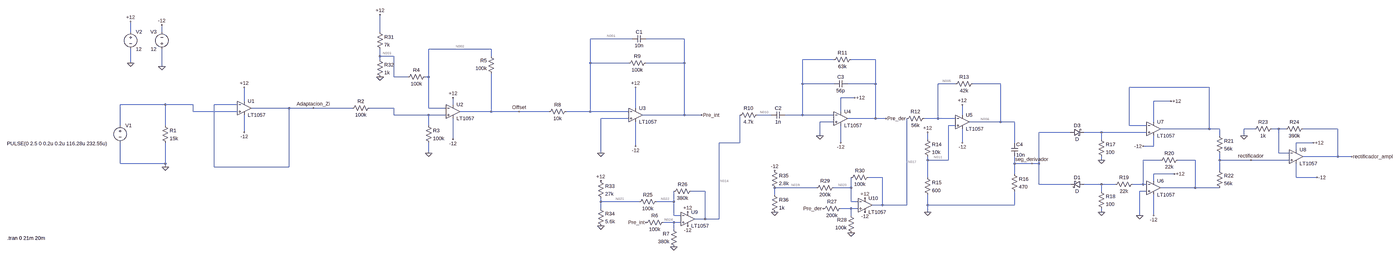
[diagram p0: schematic simulacion.asc, whole sheet]
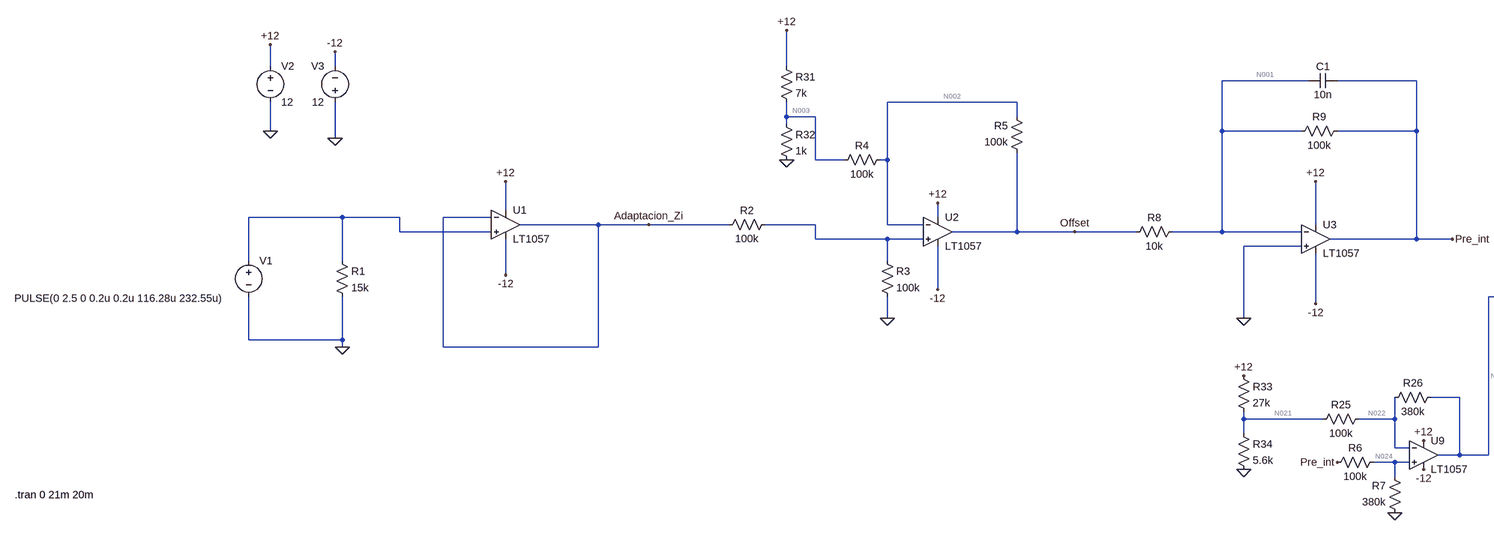
[diagram p1: schematic simulacion.asc, part, row 1 of 1, column 1 of 2]
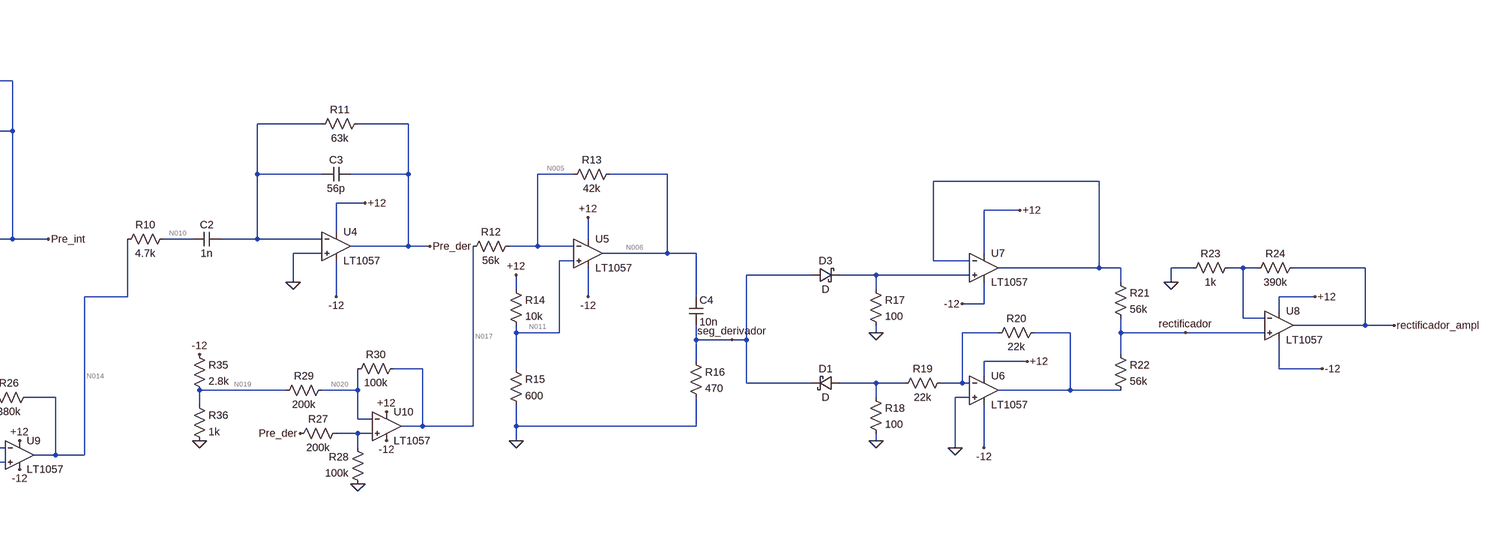
[diagram p2: schematic simulacion.asc, part, row 1 of 1, column 2 of 2]
simulacion.asc, the LTspice schematic file:
Version 4.1
SHEET 1 6116 876
WIRE 16 -304 16 -352
WIRE 160 -304 160 -336
WIRE 1264 -304 1264 -384
WIRE 2576 -272 2384 -272
WIRE 2816 -272 2640 -272
WIRE 1776 -224 1488 -224
WIRE 1264 -192 1264 -224
WIRE 1328 -192 1264 -192
WIRE 1776 -192 1776 -224
WIRE 1264 -176 1264 -192
WIRE 3504 -176 3360 -176
WIRE 3696 -176 3584 -176
WIRE 16 -160 16 -224
WIRE 2384 -160 2384 -272
WIRE 2560 -160 2384 -160
WIRE 2816 -160 2816 -272
WIRE 2816 -160 2640 -160
WIRE 160 -144 160 -224
WIRE 1328 -96 1328 -192
WIRE 1392 -96 1328 -96
WIRE 1488 -96 1488 -224
WIRE 1488 -96 1472 -96
WIRE 3360 -64 3360 -176
WIRE 3504 -64 3360 -64
WIRE 3696 -64 3696 -176
WIRE 3696 -64 3568 -64
WIRE 4064 -64 3984 -64
WIRE 4272 -64 4144 -64
WIRE 5232 -48 4864 -48
WIRE 3600 0 3536 0
WIRE 576 16 576 -48
WIRE 5056 16 4976 16
WIRE 176 32 -32 32
WIRE 304 32 176 32
WIRE 544 32 400 32
WIRE 1600 32 1600 0
WIRE 784 48 608 48
WIRE 896 48 784 48
WIRE 1136 48 896 48
WIRE 1328 48 1216 48
WIRE 1488 48 1488 -96
WIRE 1568 48 1488 48
WIRE 2592 48 2592 -48
WIRE 304 64 304 32
WIRE 544 64 304 64
WIRE 1776 64 1776 -112
WIRE 1776 64 1632 64
WIRE 1904 64 1776 64
WIRE 2128 64 1904 64
WIRE 2384 64 2384 -160
WIRE 2384 64 2208 64
WIRE 2560 64 2384 64
WIRE 3536 64 3536 0
WIRE 1328 80 1328 48
WIRE 1488 80 1328 80
WIRE 1568 80 1488 80
WIRE 2816 80 2816 -160
WIRE 2816 80 2624 80
WIRE 2896 80 2816 80
WIRE 3216 80 3152 80
WIRE 3360 80 3360 -64
WIRE 3360 80 3280 80
WIRE 3504 80 3360 80
WIRE 4096 80 4096 32
WIRE 2560 96 2432 96
WIRE 3696 96 3696 -64
WIRE 3696 96 3568 96
WIRE 3744 96 3696 96
WIRE 3984 96 3984 -64
WIRE 3984 96 3920 96
WIRE 4064 96 3984 96
WIRE 3504 112 3440 112
WIRE 4272 112 4272 -64
WIRE 4272 112 4128 112
WIRE 4336 112 4272 112
WIRE 4976 112 4976 16
WIRE -32 128 -32 32
WIRE 176 128 176 32
WIRE 1488 128 1488 80
WIRE 4064 128 4032 128
WIRE 4864 128 4864 -48
WIRE 4944 128 4864 128
WIRE 5232 144 5232 -48
WIRE 5232 144 5008 144
WIRE 5280 144 5232 144
WIRE 5440 144 5392 144
WIRE 5552 144 5520 144
WIRE 5584 144 5552 144
WIRE 5824 144 5664 144
WIRE 576 160 576 80
WIRE 4592 160 4448 160
WIRE 4736 160 4656 160
WIRE 4944 160 4736 160
WIRE 3440 176 3440 112
WIRE 5280 176 5280 144
WIRE 5392 176 5392 144
WIRE 1600 192 1600 96
WIRE 3936 192 3936 160
WIRE 4736 192 4736 160
WIRE 3072 208 3072 80
WIRE 3072 208 2976 208
WIRE 3536 208 3536 128
WIRE 4096 208 4096 144
WIRE 4336 208 4336 112
WIRE 5712 208 5632 208
WIRE 2592 224 2592 112
WIRE 4976 224 4976 176
WIRE 4976 224 4928 224
WIRE 5632 240 5632 208
WIRE 1488 256 1488 208
WIRE 2432 256 2432 96
WIRE 5552 256 5552 144
WIRE 5600 256 5552 256
WIRE 5824 272 5824 144
WIRE 5824 272 5664 272
WIRE 5888 272 5824 272
WIRE 3936 288 3936 272
WIRE 4032 288 4032 128
WIRE 4032 288 3936 288
WIRE 4736 288 4736 272
WIRE 5008 288 4928 288
WIRE 5168 288 5088 288
WIRE 5280 288 5280 256
WIRE 5424 288 5280 288
WIRE 5600 288 5424 288
WIRE -32 304 -32 208
WIRE 176 304 176 208
WIRE 176 304 -32 304
WIRE 4336 304 4336 272
WIRE 4416 304 4336 304
WIRE 4448 304 4448 160
WIRE 4448 304 4416 304
WIRE 176 320 176 304
WIRE 400 320 400 32
WIRE 784 320 784 48
WIRE 784 320 400 320
WIRE 5280 336 5280 288
WIRE 4336 352 4336 304
WIRE 5072 352 4976 352
WIRE 3728 368 3664 368
WIRE 3936 368 3936 288
WIRE 5632 368 5632 304
WIRE 5728 368 5632 368
WIRE 4976 384 4976 352
WIRE 4448 400 4448 304
WIRE 4592 400 4448 400
WIRE 4736 400 4656 400
WIRE 4800 400 4736 400
WIRE 4928 400 4928 288
WIRE 4928 400 4880 400
WIRE 4944 400 4928 400
WIRE 3424 416 3232 416
WIRE 3584 416 3584 368
WIRE 3584 416 3504 416
WIRE 5168 416 5168 288
WIRE 5168 416 5008 416
WIRE 5280 416 5168 416
WIRE 2912 432 2848 432
WIRE 4736 432 4736 400
WIRE 4944 432 4912 432
WIRE 3232 448 3232 416
WIRE 2432 480 2432 464
WIRE 2608 480 2432 480
WIRE 2768 480 2768 432
WIRE 2768 480 2688 480
WIRE 3584 480 3584 416
WIRE 3616 480 3584 480
WIRE 3728 496 3728 368
WIRE 3728 496 3680 496
WIRE 3840 496 3840 96
WIRE 3840 496 3728 496
WIRE 3936 496 3936 448
WIRE 4336 496 4336 432
WIRE 4336 496 3936 496
WIRE 2432 512 2432 480
WIRE 3584 512 3536 512
WIRE 3616 512 3584 512
WIRE 3936 528 3936 496
WIRE 4736 528 4736 512
WIRE 2768 544 2768 480
WIRE 2800 544 2768 544
WIRE 3584 544 3584 512
WIRE 4912 544 4912 432
WIRE 4976 544 4976 448
WIRE 2912 560 2912 432
WIRE 2912 560 2864 560
WIRE 2976 560 2976 208
WIRE 2976 560 2912 560
WIRE 2768 576 2720 576
WIRE 2800 576 2768 576
WIRE 2768 608 2768 576
FLAG 16 -160 0
FLAG 176 320 0
FLAG 160 -144 0
FLAG 16 -352 +12
FLAG 576 -48 +12
FLAG 160 -336 -12
FLAG 576 160 -12
FLAG 1904 64 Offset
FLAG 896 48 Adaptacion_Zi
FLAG 2592 224 -12
FLAG 2592 -48 +12
FLAG 1600 0 +12
FLAG 1600 192 -12
FLAG 3600 0 +12
FLAG 3536 208 -12
FLAG 3440 176 0
FLAG 4096 32 +12
FLAG 4096 208 -12
FLAG 3936 160 +12
FLAG 3936 528 0
FLAG 4736 288 0
FLAG 4736 528 0
FLAG 5072 352 +12
FLAG 4976 544 -12
FLAG 4912 544 0
FLAG 5056 16 +12
FLAG 4928 224 -12
FLAG 5392 176 0
FLAG 5712 208 +12
FLAG 5728 368 -12
FLAG 5424 288 rectificador
FLAG 5888 272 rectificador_ampl
FLAG 4416 304 seg_derivador
FLAG 1488 256 0
FLAG 2768 688 0
FLAG 2832 528 +12
FLAG 2832 592 -12
FLAG 2640 576 Pre_int
FLAG 2432 256 0
FLAG 2896 80 Pre_int
FLAG 3584 624 0
FLAG 3648 464 +12
FLAG 3648 528 -12
FLAG 3456 512 Pre_der
FLAG 3744 96 Pre_der
FLAG 1264 -96 0
FLAG 1264 -384 +12
FLAG 2432 384 +12
FLAG 2432 592 0
FLAG 3232 528 0
FLAG 3232 336 -12
SYMBOL voltage -32 112 R0
WINDOW 3 -521 100 Left 2
WINDOW 123 0 0 Left 0
WINDOW 39 0 0 Left 0
SYMATTR Value PULSE(0 2.5 0 0.2u 0.2u 116.28u 232.55u)
SYMATTR InstName V1
SYMBOL voltage 16 -320 R0
SYMATTR InstName V2
SYMATTR Value 12
SYMBOL res 160 112 R0
SYMATTR InstName R1
SYMATTR Value 15k
SYMBOL voltage 160 -208 R180
WINDOW 0 24 96 Left 2
WINDOW 3 24 16 Left 2
SYMATTR InstName V3
SYMATTR Value 12
SYMBOL OpAmps\\LT1057 576 -16 R0
SYMATTR InstName U1
SYMBOL res 1232 32 R90
WINDOW 0 0 56 VBottom 2
WINDOW 3 32 56 VTop 2
SYMATTR InstName R2
SYMATTR Value 100k
SYMBOL OpAmps\\LT1057 1600 0 R0
SYMATTR InstName U2
SYMBOL res 2224 48 R90
WINDOW 0 0 56 VBottom 2
WINDOW 3 32 56 VTop 2
SYMATTR InstName R8
SYMATTR Value 10k
SYMBOL cap 2640 -288 R90
WINDOW 0 0 32 VBottom 2
WINDOW 3 32 32 VTop 2
SYMATTR InstName C1
SYMATTR Value 10n
SYMBOL OpAmps\\LT1057 2592 16 R0
SYMATTR InstName U3
SYMBOL res 2656 -176 R90
WINDOW 0 0 56 VBottom 2
WINDOW 3 32 56 VTop 2
SYMATTR InstName R9
SYMATTR Value 100k
SYMBOL res 3168 64 R90
WINDOW 0 0 56 VBottom 2
WINDOW 3 32 56 VTop 2
SYMATTR InstName R10
SYMATTR Value 4.7k
SYMBOL cap 3280 64 R90
WINDOW 0 0 32 VBottom 2
WINDOW 3 32 32 VTop 2
SYMATTR InstName C2
SYMATTR Value 1n
SYMBOL cap 3568 -80 R90
WINDOW 0 0 32 VBottom 2
WINDOW 3 32 32 VTop 2
SYMATTR InstName C3
SYMATTR Value 56p
SYMBOL res 3600 -192 R90
WINDOW 0 0 56 VBottom 2
WINDOW 3 32 56 VTop 2
SYMATTR InstName R11
SYMATTR Value 63k
SYMBOL OpAmps\\LT1057 3536 32 R0
SYMATTR InstName U4
SYMBOL res 3936 80 R90
WINDOW 0 0 56 VBottom 2
WINDOW 3 32 56 VTop 2
SYMATTR InstName R12
SYMATTR Value 56k
SYMBOL res 4160 -80 R90
WINDOW 0 0 56 VBottom 2
WINDOW 3 32 56 VTop 2
SYMATTR InstName R13
SYMATTR Value 42k
SYMBOL OpAmps\\LT1057 4096 48 R0
SYMATTR InstName U5
SYMBOL res 3920 176 R0
SYMATTR InstName R14
SYMATTR Value 10k
SYMBOL res 3920 352 R0
SYMATTR InstName R15
SYMATTR Value 600
SYMBOL res 4320 336 R0
SYMATTR InstName R16
SYMATTR Value 470
SYMBOL cap 4320 208 R0
SYMATTR InstName C4
SYMATTR Value 10n
SYMBOL res 4720 176 R0
SYMATTR InstName R17
SYMATTR Value 100
SYMBOL res 4720 416 R0
SYMATTR InstName R18
SYMATTR Value 100
SYMBOL res 4896 384 R90
WINDOW 0 0 56 VBottom 2
WINDOW 3 32 56 VTop 2
SYMATTR InstName R19
SYMATTR Value 22k
SYMBOL OpAmps\\LT1057 4976 352 R0
SYMATTR InstName U6
SYMBOL OpAmps\\LT1057 4976 80 R0
SYMATTR InstName U7
SYMBOL res 5104 272 R90
WINDOW 0 0 56 VBottom 2
WINDOW 3 32 56 VTop 2
SYMATTR InstName R20
SYMATTR Value 22k
SYMBOL res 5264 160 R0
SYMATTR InstName R21
SYMATTR Value 56k
SYMBOL res 5264 320 R0
SYMATTR InstName R22
SYMATTR Value 56k
SYMBOL schottky 4592 176 R270
WINDOW 0 32 32 VTop 2
WINDOW 3 0 32 VBottom 2
SYMATTR InstName D3
SYMBOL schottky 4656 384 R90
WINDOW 0 0 32 VBottom 2
WINDOW 3 32 32 VTop 2
SYMATTR InstName D1
SYMBOL OpAmps\\LT1057 5632 208 R0
SYMATTR InstName U8
SYMBOL res 5536 128 R90
WINDOW 0 0 56 VBottom 2
WINDOW 3 32 56 VTop 2
SYMATTR InstName R23
SYMATTR Value 1k
SYMBOL res 5680 128 R90
WINDOW 0 0 56 VBottom 2
WINDOW 3 32 56 VTop 2
SYMATTR InstName R24
SYMATTR Value 390k
SYMBOL res 1792 -96 R180
WINDOW 0 36 76 Left 2
WINDOW 3 36 40 Left 2
SYMATTR InstName R5
SYMATTR Value 100k
SYMBOL res 1488 -112 R90
WINDOW 0 0 56 VBottom 2
WINDOW 3 32 56 VTop 2
SYMATTR InstName R4
SYMATTR Value 100k
SYMBOL res 1472 112 R0
SYMATTR InstName R3
SYMATTR Value 100k
SYMBOL OpAmps\\LT1057 2832 496 R0
SYMATTR InstName U9
SYMBOL res 2736 560 R90
WINDOW 0 0 56 VBottom 2
WINDOW 3 32 56 VTop 2
SYMATTR InstName R6
SYMATTR Value 100k
SYMBOL res 2784 704 R180
WINDOW 0 36 76 Left 2
WINDOW 3 36 40 Left 2
SYMATTR InstName R7
SYMATTR Value 380k
SYMBOL res 2704 464 R90
WINDOW 0 0 56 VBottom 2
WINDOW 3 32 56 VTop 2
SYMATTR InstName R25
SYMATTR Value 100k
SYMBOL res 2864 416 R90
WINDOW 0 0 56 VBottom 2
WINDOW 3 32 56 VTop 2
SYMATTR InstName R26
SYMATTR Value 380k
SYMBOL OpAmps\\LT1057 3648 432 R0
SYMATTR InstName U10
SYMBOL res 3552 496 R90
WINDOW 0 0 56 VBottom 2
WINDOW 3 32 56 VTop 2
SYMATTR InstName R27
SYMATTR Value 200k
SYMBOL res 3600 640 R180
WINDOW 0 36 76 Left 2
WINDOW 3 36 40 Left 2
SYMATTR InstName R28
SYMATTR Value 100k
SYMBOL res 3520 400 R90
WINDOW 0 0 56 VBottom 2
WINDOW 3 32 56 VTop 2
SYMATTR InstName R29
SYMATTR Value 200k
SYMBOL res 3680 352 R90
WINDOW 0 0 56 VBottom 2
WINDOW 3 32 56 VTop 2
SYMATTR InstName R30
SYMATTR Value 100k
SYMBOL res 1248 -320 R0
SYMATTR InstName R31
SYMATTR Value 7k
SYMBOL res 1248 -192 R0
SYMATTR InstName R32
SYMATTR Value 1k
SYMBOL res 2416 368 R0
SYMATTR InstName R33
SYMATTR Value 27k
SYMBOL res 2416 496 R0
SYMATTR InstName R34
SYMATTR Value 5.6k
SYMBOL res 3216 320 R0
SYMATTR InstName R35
SYMATTR Value 2.8k
SYMBOL res 3216 432 R0
SYMATTR InstName R36
SYMATTR Value 1k
TEXT -552 648 Left 2 !.tran 0 21m 20m

The netlist it stands for:
* simulacion.asc
V1 N008 0 PULSE(0 2.5 0 0.2u 0.2u 116.28u 232.55u)
V2 +12 0 12
R1 N008 0 15k
V3 0 -12 12
X§U1 N008 Adaptacion_Zi +12 -12 Adaptacion_Zi LT1057  ; pins In+ In- V+ V- OUT
R2 N009 Adaptacion_Zi 100k
X§U2 N009 N002 +12 -12 Offset LT1057  ; pins In+ In- V+ V- OUT
R8 N001 Offset 10k
C1 Pre_int N001 10n
X§U3 0 N001 +12 -12 Pre_int LT1057  ; pins In+ In- V+ V- OUT
R9 Pre_int N001 100k
R10 N010 N014 4.7k
C2 N004 N010 1n
C3 Pre_der N004 56p
R11 Pre_der N004 63k
X§U4 0 N004 +12 -12 Pre_der LT1057  ; pins In+ In- V+ V- OUT
R12 N005 N017 56k
R13 N006 N005 42k
X§U5 N011 N005 +12 -12 N006 LT1057  ; pins In+ In- V+ V- OUT
R14 +12 N011 10k
R15 N011 0 600
R16 seg_derivador 0 470
C4 N006 seg_derivador 10n
R17 N013 0 100
R18 N018 0 100
R19 N015 N018 22k
X§U6 0 N015 +12 -12 N016 LT1057  ; pins In+ In- V+ V- OUT
X§U7 N013 N007 +12 -12 N007 LT1057  ; pins In+ In- V+ V- OUT
R20 N016 N015 22k
R21 N007 rectificador 56k
R22 rectificador N016 56k
D3 seg_derivador N013 D
D1 N018 seg_derivador D
X§U8 rectificador N012 +12 -12 rectificador_ampl LT1057  ; pins In+ In- V+ V- OUT
R23 N012 0 1k
R24 rectificador_ampl N012 390k
R5 Offset N002 100k
R4 N002 N003 100k
R3 N009 0 100k
X§U9 N024 N022 +12 -12 N014 LT1057  ; pins In+ In- V+ V- OUT
R6 N024 Pre_int 100k
R7 0 N024 380k
R25 N022 N021 100k
R26 N014 N022 380k
X§U10 N023 N020 +12 -12 N017 LT1057  ; pins In+ In- V+ V- OUT
R27 N023 Pre_der 200k
R28 0 N023 100k
R29 N020 N019 200k
R30 N017 N020 100k
R31 +12 N003 7k
R32 N003 0 1k
R33 +12 N021 27k
R34 N021 0 5.6k
R35 -12 N019 2.8k
R36 N019 0 1k
.model D D
.lib standard.dio
.tran 0 21m 20m
.lib LTC.lib
.backanno
.end

* Results of the author's LTspice run, read from the files saved beside the schematic
* Operating Point, zero values left out:
*   V(+12) = 12 V
*   V(-12) = -12 V
*   V(n001) = -419 mV
*   V(n002) = 4.484 µV
*   V(n003) = 1.487 V
*   V(n005) = 679.2 mV
*   V(n006) = 8.821 mV
*   V(n010) = 10.28 V
*   V(n011) = 679.2 mV
*   V(n014) = 10.28 V
*   V(n017) = 1.573 V
*   V(n019) = -3.146 V
*   V(n020) = -4.725 µV
*   V(n021) = 2.14 V
*   V(n022) = 3.835 V
*   V(n024) = 8.123 V
*   V(offset) = -1.487 V
*   V(pre_int) = 10.26 V
*   I(R12) = -15.96 µA
*   I(R13) = -15.96 µA
*   I(R14) = 1.132 mA
*   I(R15) = 1.132 mA
*   I(R25) = 16.95 µA
*   I(R26) = 16.95 µA
*   I(R29) = 15.73 µA
*   I(R30) = 15.73 µA
*   I(R31) = 1.502 mA
*   I(R32) = 1.487 mA
*   I(R33) = 365.2 µA
*   I(R34) = 382.1 µA
*   I(R35) = -3.162 mA
*   I(R36) = -3.146 mA
*   I(R4) = -14.87 µA
*   I(R5) = -14.87 µA
*   I(R6) = -21.38 µA
*   I(R7) = -21.38 µA
*   I(R8) = 106.8 µA
*   I(R9) = 106.8 µA
*   I(V2) = -19.01 mA
*   I(V3) = -19.14 mA
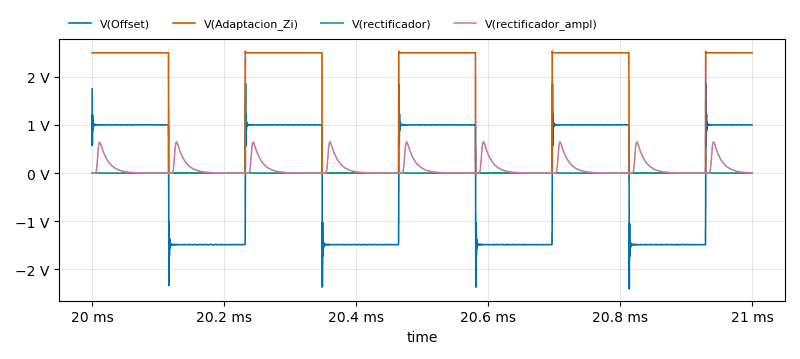
[diagram p3: Transient Analysis of simulacion.asc, plotted from the saved traces]
* Transient Analysis, 1 run:
*   V(Offset): min -2.406 V, max 1.861 V, average -153.9 mV, rms 1.252 V, last 1 V
*   V(Adaptacion_Zi): min -41.16 mV, max 2.533 V, average 1.339 V, rms 1.829 V, last 2.5 V
*   V(rectificador): min -26.82 µV, max 7.403 mV, average 243.9 µV, rms 1.131 mV, last 16.45 µV
*   V(rectificador_ampl): min 20.89 µV, max 652.4 mV, average 95.16 mV, rms 190 mV, last 5.768 mV